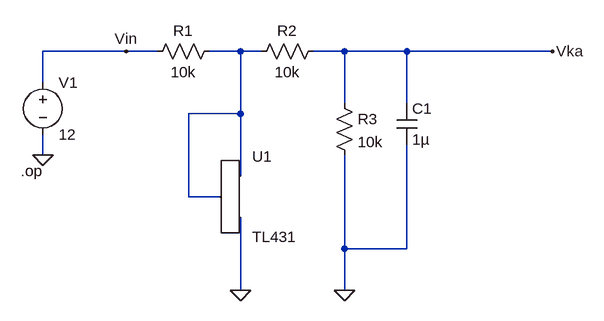
[diagram p0: schematic CJ431-1v25ref.asc]
CJ431-1v25ref.asc, the LTspice schematic file:
Version 4
SHEET 1 880 680
WIRE 80 96 -48 96
WIRE 128 96 80 96
WIRE 256 96 208 96
WIRE 288 96 256 96
WIRE 416 96 368 96
WIRE 512 96 416 96
WIRE 736 96 512 96
WIRE -48 144 -48 96
WIRE 416 176 416 96
WIRE 512 176 512 96
WIRE 256 192 256 96
WIRE 256 192 176 192
WIRE -48 256 -48 224
WIRE 256 288 256 192
WIRE 176 320 176 192
WIRE 224 320 176 320
WIRE 416 400 416 256
WIRE 512 400 512 240
WIRE 512 400 416 400
WIRE 256 464 256 352
WIRE 416 464 416 400
FLAG 256 464 0
FLAG 736 96 Vka
FLAG 80 96 Vin
FLAG -48 256 0
FLAG 416 464 0
SYMBOL ZZZ\\REF\\TL431 240 288 R0
SYMATTR InstName U1
SYMBOL res 224 80 R90
WINDOW 0 0 56 VBottom 2
WINDOW 3 32 56 VTop 2
SYMATTR InstName R1
SYMATTR Value 10k
SYMBOL voltage -48 128 R0
WINDOW 123 0 0 Left 0
WINDOW 39 0 0 Left 0
SYMATTR InstName V1
SYMATTR Value 12
SYMBOL res 384 80 R90
WINDOW 0 0 56 VBottom 2
WINDOW 3 32 56 VTop 2
SYMATTR InstName R2
SYMATTR Value 10k
SYMBOL res 400 160 R0
SYMATTR InstName R3
SYMATTR Value 10k
SYMBOL cap 496 176 R0
SYMATTR InstName C1
SYMATTR Value 1µ
TEXT -82 280 Left 2 !.op

The netlist it stands for:
* CJ431-1v25ref.asc
XU1 N001 0 N001 TL431
R1 N001 Vin 10k
V1 Vin 0 12
R2 Vka N001 10k
R3 Vka 0 10k
C1 Vka 0 1µ
.op
.lib TL431.mod
.backanno
.end